# EAGLE design ADE7880_Breakout (EAGLE 9.6.2)
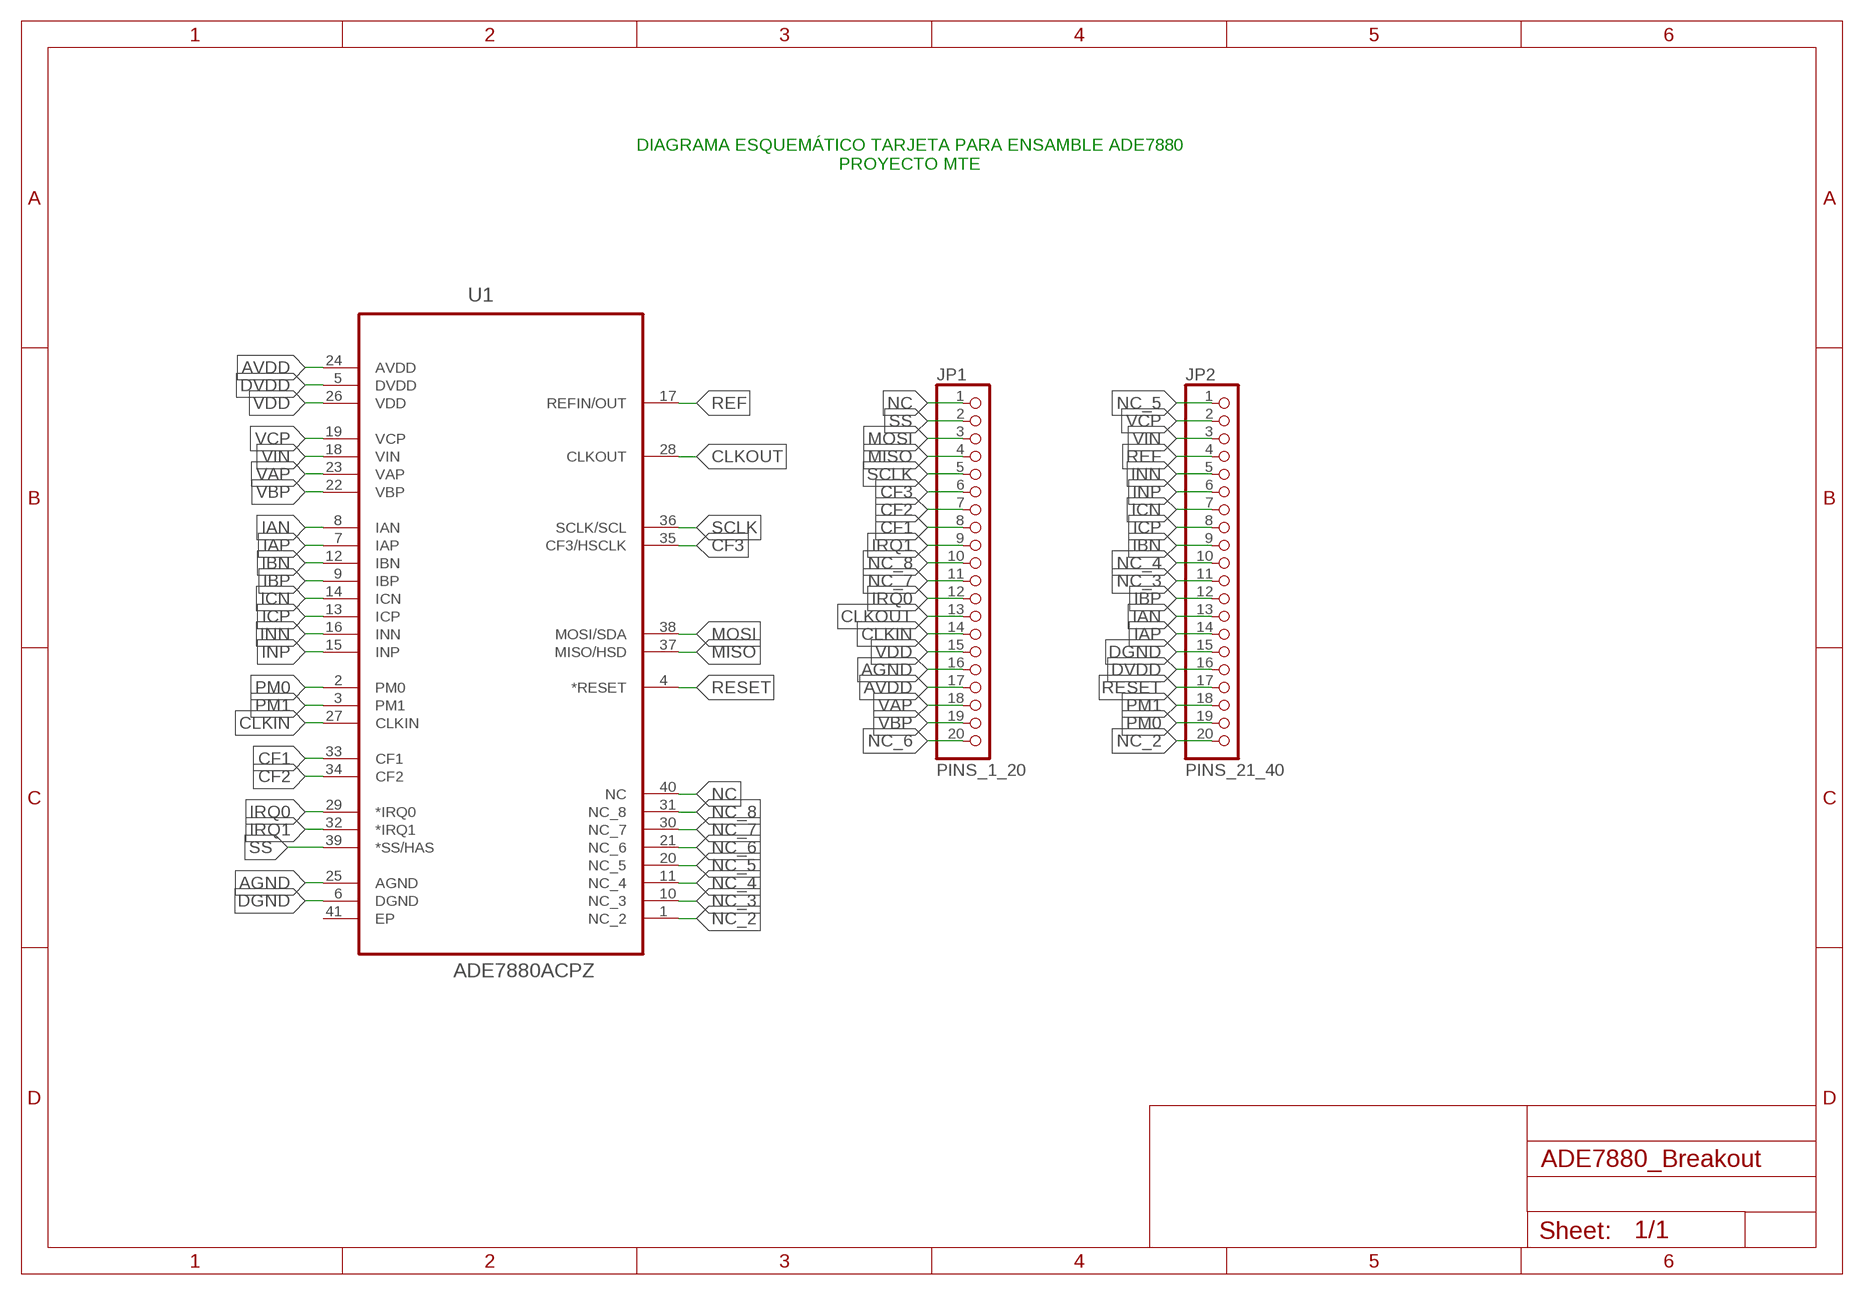
[diagram p0: schematic, sheet 1]

## Parts
JP1  PINS_1_20  PINHD-1X20  [1X20]
JP2  PINS_21_40  PINHD-1X20  [1X20]
U1  ADE7880ACPZ  [QFN50P600X600X80-41N]

## Nets
AGND: JP1.16 U1.25(AGND)
AVDD: JP1.17 U1.24(AVDD)
CF1: JP1.8 U1.33(CF1)
CF2: JP1.7 U1.34(CF2)
CF3: JP1.6 U1.35(CF3/HSCLK)
CLKIN: JP1.14 U1.27(CLKIN)
CLKOUT: JP1.13 U1.28(CLKOUT)
DGND: JP2.15 U1.6(DGND)
DVDD: JP2.16 U1.5(DVDD)
IAN: JP2.13 U1.8(IAN)
IAP: JP2.14 U1.7(IAP)
IBN: JP2.9 U1.12(IBN)
IBP: JP2.12 U1.9(IBP)
ICN: JP2.7 U1.14(ICN)
ICP: JP2.8 U1.13(ICP)
INN: JP2.5 U1.16(INN)
INP: JP2.6 U1.15(INP)
IRQ0: JP1.12 U1.29(*IRQ0)
IRQ1: JP1.9 U1.32(*IRQ1)
MISO: JP1.4 U1.37(MISO/HSD)
MOSI: JP1.3 U1.38(MOSI/SDA)
NC: JP1.1 U1.40(NC)
NC_2: JP2.20 U1.1(NC_2)
NC_3: JP2.11 U1.10(NC_3)
NC_4: JP2.10 U1.11(NC_4)
NC_5: JP2.1 U1.20(NC_5)
NC_6: JP1.20 U1.21(NC_6)
NC_7: JP1.11 U1.30(NC_7)
NC_8: JP1.10 U1.31(NC_8)
PM0: JP2.19 U1.2(PM0)
PM1: JP2.18 U1.3(PM1)
REF: JP2.4 U1.17(REFIN/OUT)
RESET: JP2.17 U1.4(*RESET)
SCLK: JP1.5 U1.36(SCLK/SCL)
SS: JP1.2 U1.39(*SS/HAS)
VAP: JP1.18 U1.23(VAP)
VBP: JP1.19 U1.22(VBP)
VCP: JP2.2 U1.19(VCP)
VDD: JP1.15 U1.26(VDD)
VIN: JP2.3 U1.18(VIN)
Unconnected: U1.41(EP)

## Notes on the sheet
- DIAGRAMA ESQUEMÁTICO TARJETA PARA ENSAMBLE ADE7880
  PROYECTO MTE

## Library data of the parts
JP1 JP2 = pinhead:PINHD-1X20: PIN HEADER
U1 = ADE7880ACPZ:ADE7880ACPZ: Polyphase Multifunction Energy Metering IC with Harmonic Monitoring Check availability <https://pricing.snapeda.com/parts/ADE7880ACPZ/Analog%20Devices/view-part?ref=eda>; AVAILABILITY: In Stock; CHECK_PRICES: https://www.snapeda.com/parts/ADE7880ACPZ/Analog+Devices/view-part/?ref=eda; DESCRIPTION: Polyphase Multifunction Energy Metering IC with Harmonic Monitoring; MF: Analog Devices; MP: ADE7880ACPZ; PACKAGE: LFCSP -40 Analog Devices; PRICE: None; PURCHASE-URL: https://www.snapeda.com/api/url_track_click_mouser/?unipart_id=44390&manufacturer=Analog Devices&part_name=ADE7880ACPZ&search_term=ade7880; SNAPEDA_LINK: https://www.snapeda.com/parts/ADE7880ACPZ/Analog+Devices/view-part/?ref=snap

## Board
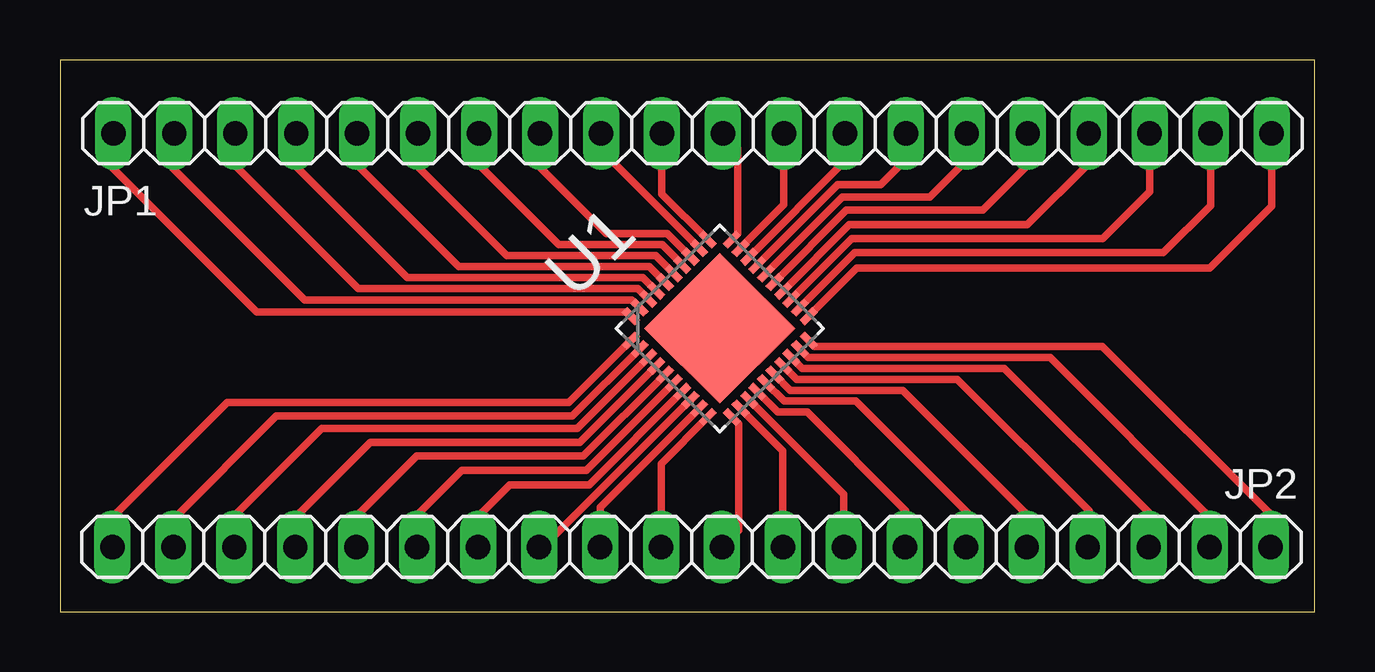
[diagram p1: board, top side]

Size 52.28 x 23 mm. Coordinates in mm from the lower left corner, seen from the top.
Outline: 0,0 52.28,0 52.28,23 0,23 0,0
Copper layers (1*16): Top 0.035mm / dielectric 1.5mm / Bottom 0.035mm
Design rules "default": minimum track width 6mil, minimum drill 0.35mm, track to track 6mil, track to pad 6mil, pad to pad 6mil, via to via 6mil, smd to smd 6mil, copper to edge 40mil, drill to drill 6mil, minimum pad ring 10mil, minimum via ring 8mil, stop-mask expansion 4mil, vias tented up to drill 0mil, thermal gap 10mil

### Footprints (pad centres in the part's own frame; a part is rotated, then mirrored left to right if it is on the bottom)
1X20 = drill 1.016 long: 1 -24.13,0; 2 -21.59,0; 3 -19.05,0; 4 -16.51,0; 5 -13.97,0; 6 -11.43,0; 7 -8.89,0; 8 -6.35,0; 9 -3.81,0; 10 -1.27,0; 11 1.27,0; 12 3.81,0; 13 6.35,0; 14 8.89,0; 15 11.43,0; 16 13.97,0; 17 16.51,0; 18 19.05,0; 19 21.59,0; 20 24.13,0
QFN50P600X600X80-41N = smd 0.762 x 0.305: 1 -2.972,2.261; 2 -2.972,1.753; 3 -2.972,1.245; 4 -2.972,0.762; 5 -2.972,0.254; 6 -2.972,-0.254; 7 -2.972,-0.762; 8 -2.972,-1.245; 9 -2.972,-1.753; 10 -2.972,-2.261; 21 2.972,-2.261; 22 2.972,-1.753; 23 2.972,-1.245; 24 2.972,-0.762; 25 2.972,-0.254; 26 2.972,0.254; 27 2.972,0.762; 28 2.972,1.245; 29 2.972,1.753; 30 2.972,2.261 | smd 0.305 x 0.762: 11 -2.261,-2.972; 12 -1.753,-2.972; 13 -1.245,-2.972; 14 -0.762,-2.972; 15 -0.254,-2.972; 16 0.254,-2.972; 17 0.762,-2.972; 18 1.245,-2.972; 19 1.753,-2.972; 20 2.261,-2.972; 31 2.261,2.972; 32 1.753,2.972; 33 1.245,2.972; 34 0.762,2.972; 35 0.254,2.972; 36 -0.254,2.972; 37 -0.762,2.972; 38 -1.245,2.972; 39 -1.753,2.972; 40 -2.261,2.972 | smd 4.445 x 4.445: 41 0,0

### Placement (x,y rotation side)
JP1  26.35,19.94 0 top
JP2  26.31,2.69 180 top
U1  27.49,11.81 45 top

### Tracks (layer width: path | path; a pad name or v marks a point on that pad's centre or on a via)
AGND
  Top 0.305: U1.25 32.77,16.73 38.44,16.73 40.32,18.61 JP1.16
AVDD
  Top 0.305: U1.24 32.89,16.13 40.31,16.13 42.86,18.68 JP1.17
CF1
  Top 0.305: JP1.8 20,18.59 19.97,18.56 22.77,15.76 25.31,15.76 26.27,14.8 U1.33
CF2
  Top 0.305: JP1.7 17.46,18.62 20.77,15.31 25.09,15.31 25.93,14.47 U1.34
CF3
  Top 0.305: JP1.6 14.92,18.54 18.61,14.85 24.82,14.85 U1.35
CLKIN
  Top 0.305: U1.27 32.4,17.8 34.2,17.8 35.24,18.84 JP1.14
CLKOUT
  Top 0.305: JP1.13 32.7,18.78 U1.28
DGND
  Top 0.305: U1.6 21.92,5.88 16.74,5.88 14.88,4.02 JP2.15
DVDD
  Top 0.305: U1.5 21.81,6.49 14.86,6.49 12.34,3.97 JP2.16
IAN
  Top 0.305: JP2.13 20.13,2.69 26.25,8.8 U1.8
IAP
  Top 0.305: U1.7 22.05,5.29 18.74,5.29 17.42,3.97 JP2.14
IBN
  Top 0.305: U1.12 30.12,6.7 JP2.9
IBP
  Top 0.305: U1.9 22.5,4.34 JP2.12
ICN
  Top 0.305: JP2.7 35.2,4.16 35.24,4.2 31.13,8.31 29.91,8.31 U1.14
ICP
  Top 0.305: U1.13 32.66,4.88 JP2.8
INN
  Top 0.305: JP2.5 40.29,4.05 35.11,9.23 30.43,9.23 U1.16
INP
  Top 0.305: JP2.6 37.74,4.03 37.82,4.11 33.16,8.77 30.17,8.77 U1.15
IRQ0
  Top 0.305: JP1.12 30.16,16.96 U1.29
IRQ1
  Top 0.305: JP1.9 22.54,19.24 U1.32
MISO
  Top 0.305: JP1.4 9.9,19.88 9.9,18.5 14.47,13.93 24.28,13.93 U1.37
MOSI
  Top 0.254: 7.3,18.6
  Top 0.305: JP1.3 7.3,18.6 | 7.3,18.6 12.42,13.48 24.08,13.48 24.51,13.04 U1.38
NC
  Top 0.254: 2.22,18.52 2.2,18.5 | U1.40 23.6,12.5
  Top 0.305: JP1.1 2.22,18.52 | 2.2,18.5 8.2,12.5 23.6,12.5
NC_2
  Top 0.305: U1.1 21.2,8.72 6.97,8.72 2.13,3.88 2.13,2.74 JP2.20
NC_3
  Top 0.305: U1.10 25.04,6.17 JP2.11
NC_4
  Top 0.305: U1.11 28.28,7.82 28.28,3.39 JP2.10
NC_5
  Top 0.305: U1.20 31.44,11.06 43.42,11.06 50.5,3.98 50.5,2.75 JP2.1
NC_6
  Top 0.305: U1.21 33.2,14.32 47.9,14.32 50.48,16.9 JP1.20
NC_7
  Top 0.305: JP1.11 28.24,19.32 28.24,15.76 U1.30
NC_8
  Top 0.305: JP1.10 25.08,17.41 U1.31
PM0
  Top 0.305: U1.2 21.35,8.15 9.02,8.15 4.72,3.85 JP2.19
PM1
  Top 0.305: U1.3 21.55,7.63 10.91,7.63 7.24,3.96 7.24,2.71 JP2.18
REF
  Top 0.305: JP2.4 42.82,4.12 42.89,4.19 37.39,9.69 30.7,9.69 U1.17
RESET
  Top 0.305: U1.4 21.65,7.05 12.92,7.05 9.8,3.93 JP2.17
SCLK
  Top 0.305: JP1.5 12.4,19.92 12.4,18.6 16.61,14.39 24.55,14.39 U1.36
SS
  Top 0.254: 4.76,18.56 4.7,18.5
  Top 0.305: JP1.2 4.76,18.56 | U1.39 23.82,13 10.2,13 4.7,18.5
VAP
  Top 0.305: U1.23 32.99,15.55 43.45,15.55 45.4,17.5 JP1.18
VBP
  Top 0.305: U1.22 33.12,14.96 45.97,14.96 47.94,16.93 JP1.19
VCP
  Top 0.305: U1.19 31.17,10.6 41.25,10.6 48.04,3.81 48.04,2.83 JP2.2
VDD
  Top 0.305: U1.26 32.6,17.28 36.24,17.28 37.78,18.82 JP1.15
VIN
  Top 0.305: JP2.3 45.36,4.13 39.35,10.14 30.93,10.14 30.48,10.59 U1.18